# EAGLE design SparkFun_LTE_Stick_LARA_R6 (EAGLE 9.6.2)
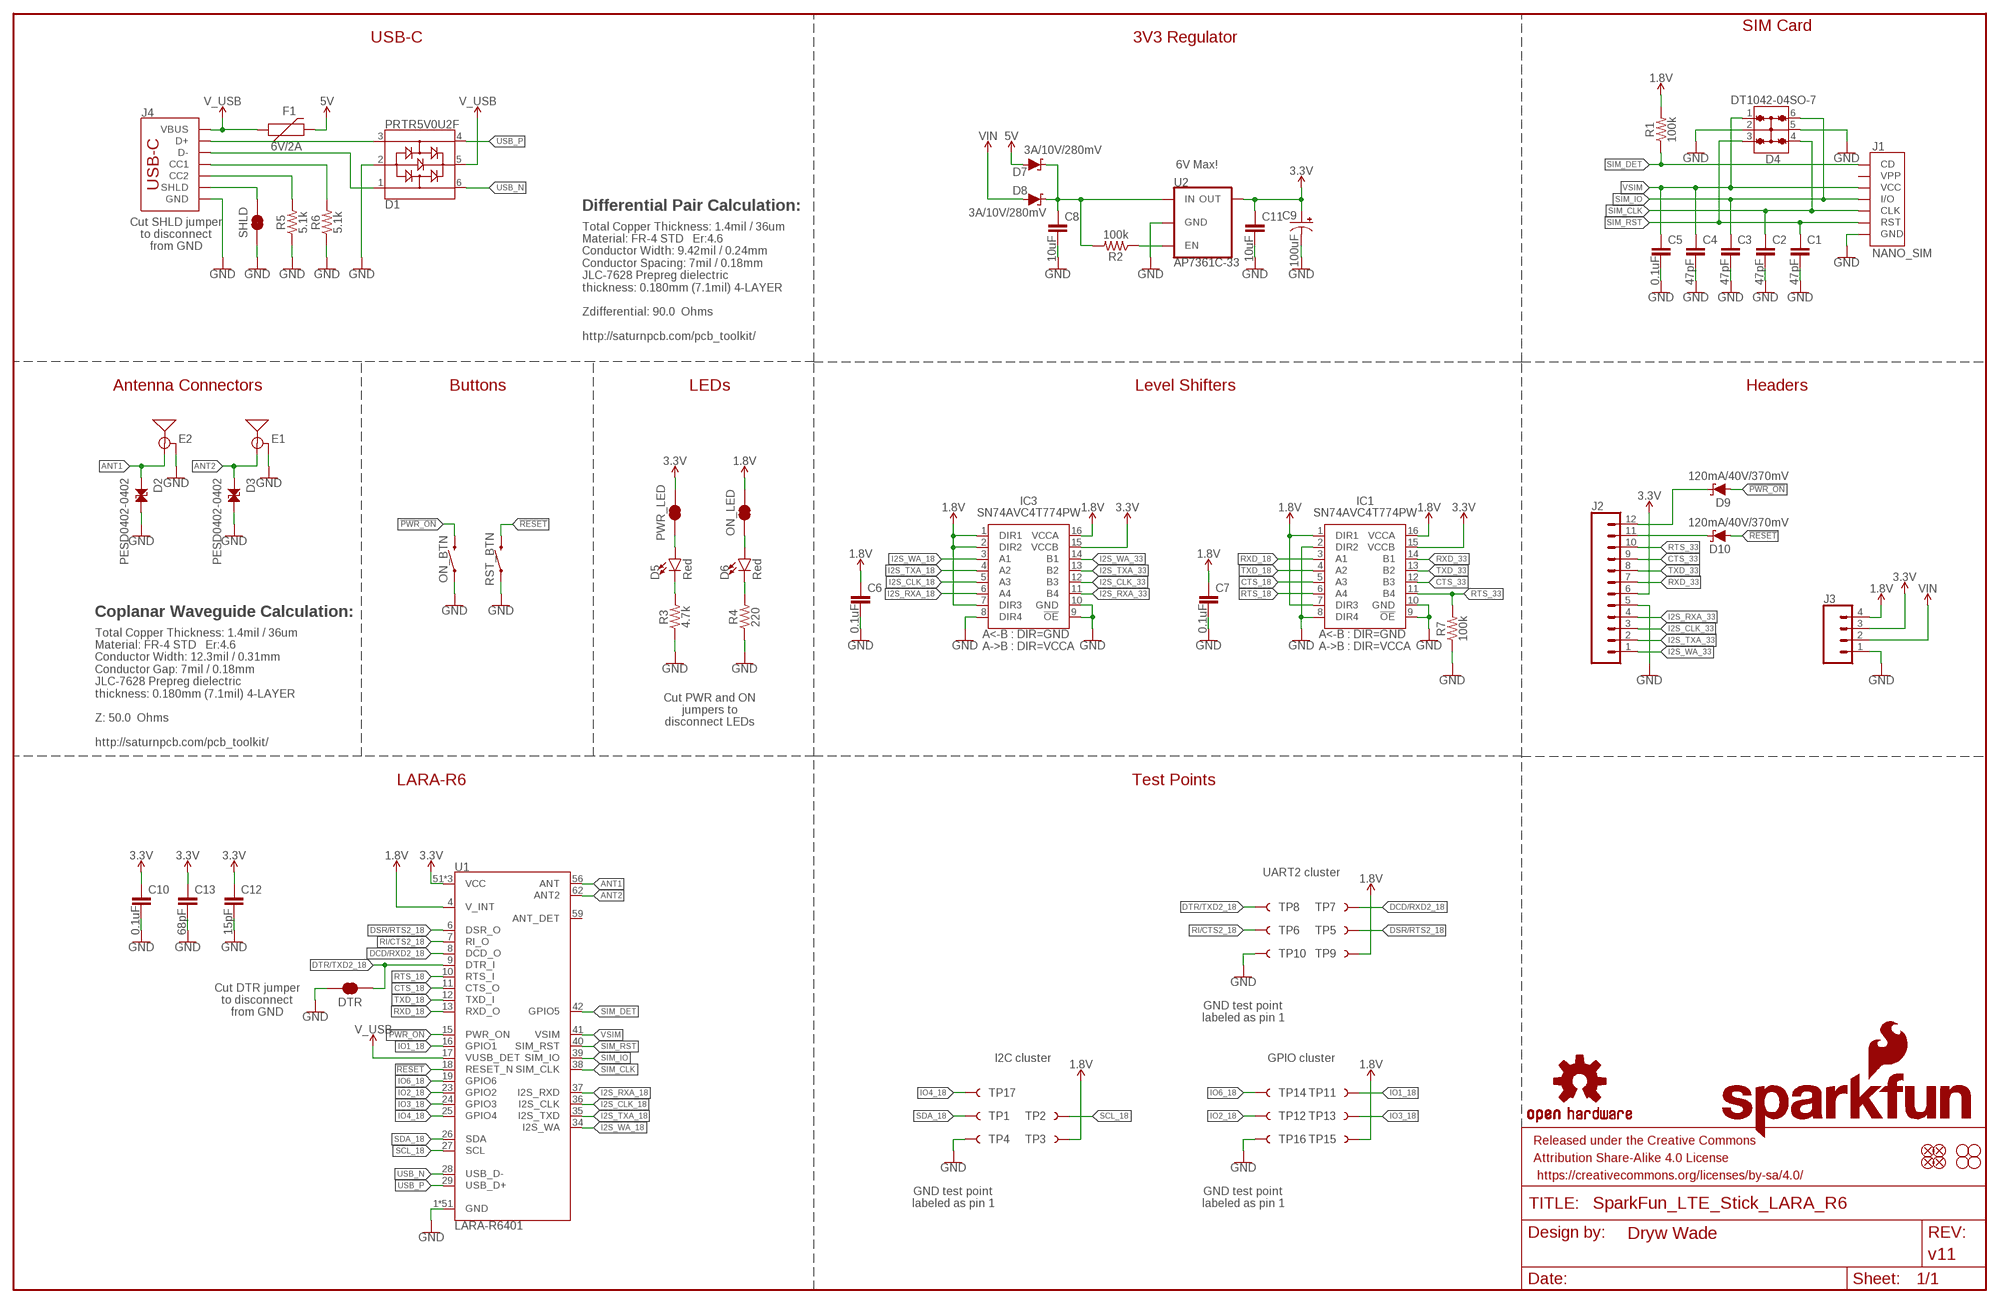
[diagram p0: schematic, sheet 1]

## Parts
C1  47pF  47PF-0603-50V-5%  [0603]
C2  47pF  47PF-0603-50V-5%  [0603]
C3  47pF  47PF-0603-50V-5%  [0603]
C4  47pF  47PF-0603-50V-5%  [0603]
C5  0.1uF  0.1UF-0603-25V-5%  [0603]
C6  0.1uF  0.1UF-0603-25V-5%  [0603]
C7  0.1uF  0.1UF-0603-25V-5%  [0603]
C8  10uF  10UF-0805-25V-10%  [0805]
C9  100uF  100UF-POLAR-35V-20%(ELEC)  [PANASONIC_D]
C10  0.1uF  0.1UF-0603-25V-5%  [0603]
C11  10uF  10UF-0805-25V-10%  [0805]
C12  15pF  15PF-0603-50V-5%  [0603]
C13  68pF  68PF-0603-50V-5%  [0603]
D1  PRTR5V0U2F  [SOT886]
D2  PESD0402-0402  [0402]
D3  PESD0402-0402  [0402]
D4  DT1042-04SO-7  TVS_DIODE_ARRAY_4_ESDA6V1BC6  [SOT23-6L]
D5  Red  LED-RED_0603-KB  [LED-0603]
D6  Red  LED-RED_0603-KB  [LED-0603]
D7  3A/10V/280mV  DIODE-SCHOTTKY-BAT60A  [SOD-323]
D8  3A/10V/280mV  DIODE-SCHOTTKY-BAT60A  [SOD-323]
D9  120mA/40V/370mV  DIODE-SCHOTTKY-RB751S40  [SOD-523]
D10  120mA/40V/370mV  DIODE-SCHOTTKY-RB751S40  [SOD-523]
DTR  JUMPER-SMT_2_NC_TRACE_SILK  [SMT-JUMPER_2_NC_TRACE_SILK]
E1  ANTENNA-SMA-GROUNDEDEDGE_SMA  [SMA-EDGE]
E2  ANTENNA-SMA-GROUNDEDEDGE_SMA  [SMA-EDGE]
F1  6V/2A  PPTC_6V2A  [1210]
FD1  FIDUCIAL1X2  [FIDUCIAL-1X2]
FD2  FIDUCIAL1X2  [FIDUCIAL-1X2]
FD3  FIDUCIAL1X2  [FIDUCIAL-1X2]
FD4  FIDUCIAL1X2  [FIDUCIAL-1X2]
FRAME1  FRAME-LEDGER  [CREATIVE_COMMONS]
H1  STAND-OFF  [STAND-OFF]
H2  STAND-OFF  [STAND-OFF]
H3  STAND-OFF  [STAND-OFF]
H4  STAND-OFF  [STAND-OFF]
IC1  SN74AVC4T774PW  [SOP65P640X120-16N]
IC3  SN74AVC4T774PW  [SOP65P640X120-16N]
J1  NANO_SIM  SIMHOLDER_WITH_CD-PUSHPUSH  [NANO_SIM_PP]
J2  CONN_12NO_SILK  [1X12_NO_SILK]
J3  CONN_041X04_NO_SILK_NO_POP  [1X04_NO_SILK]
J4  USB_C_4-LAYER_PADS  [USB-C-16P_4LAYER-PADS]
LOGO1  SFE_LOGO_NAME_FLAME.1_INCH  [SFE_LOGO_NAME_FLAME_.1]
LOGO2  OSHW-LOGOM  [OSHW-LOGO-M]
ON_BTN  MOMENTARY-SWITCH-SPST-SMD-4.6X2.8MM  [TACTILE_SWITCH_SMD_4.6X2.8MM]
ON_LED  JUMPER-SMT_2_NC_TRACE_SILK  [SMT-JUMPER_2_NC_TRACE_SILK]
PWR_LED  JUMPER-SMT_2_NC_TRACE_SILK  [SMT-JUMPER_2_NC_TRACE_SILK]
R1  100k  100KOHM-0603-1/10W-1%  [0603]
R2  100k  100KOHM-0603-1/10W-1%  [0603]
R3  4.7k  4.7KOHM-0603-1/10W-1%  [0603]
R4  220  220OHM-0603-1/10W-1%  [0603]
R5  5.1k  5.1KOHM5.1KOHM-0603-1/10W-1%  [0603]
R6  5.1k  5.1KOHM5.1KOHM-0603-1/10W-1%  [0603]
R7  100k  100KOHM-0603-1/10W-1%  [0603]
RST_BTN  MOMENTARY-SWITCH-SPST-SMD-4.6X2.8MM  [TACTILE_SWITCH_SMD_4.6X2.8MM]
SHLD  JUMPER-SMT_2_NC_TRACE_SILK  [SMT-JUMPER_2_NC_TRACE_SILK]
TP1  TEST-POINT3X5  [PAD.03X.05]
TP2  TEST-POINT3X5  [PAD.03X.05]
TP3  TEST-POINT3X5  [PAD.03X.05]
TP4  TEST-POINT3X5  [PAD.03X.05]
TP5  TEST-POINT3X5  [PAD.03X.05]
TP6  TEST-POINT3X5  [PAD.03X.05]
TP7  TEST-POINT3X5  [PAD.03X.05]
TP8  TEST-POINT3X5  [PAD.03X.05]
TP9  TEST-POINT3X5  [PAD.03X.05]
TP10  TEST-POINT3X5  [PAD.03X.05]
TP11  TEST-POINT3X5  [PAD.03X.05]
TP12  TEST-POINT3X5  [PAD.03X.05]
TP13  TEST-POINT3X5  [PAD.03X.05]
TP14  TEST-POINT3X5  [PAD.03X.05]
TP15  TEST-POINT3X5  [PAD.03X.05]
TP16  TEST-POINT3X5  [PAD.03X.05]
TP17  TEST-POINT3X5  [PAD.03X.05]
U1  LARA-R6401  LARA-R6_R6401_USA  [LARA-LGA]
U2  AP7361C-33  AP7361C-33FGEUDFN-8  [UDFN-8]

## Nets
1.8V: C6.1 C7.1 IC1.1(DIR1) IC1.7(DIR3) IC1.16(VCCA) IC3.1(DIR1) IC3.2(DIR2) IC3.7(DIR3) IC3.16(VCCA) J3.4 ON_LED.2 R1.2 TP3.1 TP9.1 TP15.1 U1.4(V_INT)
3.3V: C9.+ C10.1 C11.1 C12.1 C13.1 IC1.15(VCCB) IC3.15(VCCB) J2.6 J3.3 PWR_LED.2 U1.51(VCC) U1.52(VCC) U1.53(VCC) U2.1(OUT)
5V: D7.A F1.2
!PWR_ON!: D9.A ON_BTN.3 ON_BTN.4 U1.15(PWR_ON)
!RESET!: D10.A RST_BTN.3 RST_BTN.4 U1.18(RESET_N)
ANT1 [RF]: D2.1 E2.SIG(SIGNAL) U1.56(ANT)
ANT2 [RF]: D3.1 E1.SIG(SIGNAL) U1.62(ANT2)
CTS_18: IC1.5(A3) U1.11(CTS_O)
CTS_33: IC1.12(B3) J2.9
DCD/RXD2_18: TP7.1 U1.8(DCD_O)
DSR/RTS2_18: TP5.1 U1.6(DSR_O)
DTR/TXD2_18: DTR.2 TP8.1 U1.9(DTR_I)
EN: R2.1 U2.5(EN)
GND: C1.2 C2.2 C3.2 C4.2 C5.2 C6.2 C7.2 C8.2 C9.- C10.2 C11.2 C12.2 C13.2 D1.2 D2.2 D3.2 D4.2 D4.5 DTR.1 E1.GND@0(GND) E1.GND@1(GND) E1.GND@2(GND) E1.GND@3(GND) E2.GND@0(GND) E2.GND@1(GND) E2.GND@2(GND) E2.GND@3(GND) IC1.2(DIR2) IC1.8(DIR4) IC1.9(!OE) IC1.10(GND) IC3.8(DIR4) IC3.9(!OE) IC3.10(GND) J1.A1(GND) J1.A2(GND) J1.A3(GND) J1.A4(GND) J1.C5(GND) J2.5 J3.1 J4.GND J4.GND2(GND) ON_BTN.1 ON_BTN.2 R3.1 R4.1 R5.1 R6.1 R7.1 RST_BTN.1 RST_BTN.2 SHLD.1 TP4.1 TP10.1 TP16.1 U1.1(GND) U1.3(GND) U1.5(GND) U1.14(GND) U1.20(GND) U1.21(GND) U1.22(GND) U1.30(GND) U1.32(GND) U1.43(GND) U1.50(GND) U1.54(GND) U1.55(GND) U1.57(GND) U1.58(GND) U1.60(GND) U1.61(GND) U1.63(GND) U1.64(GND) U1.65(GND) U1.66(GND) U1.67(GND) U1.68(GND) U1.69(GND) U1.70(GND) U1.71(GND) U1.72(GND) U1.73(GND) U1.74(GND) U1.75(GND) U1.76(GND) U1.77(GND) U1.78(GND) U1.79(GND) U1.80(GND) U1.81(GND) U1.82(GND) U1.83(GND) U1.84(GND) U1.85(GND) U1.86(GND) U1.87(GND) U1.88(GND) U1.89(GND) U1.90(GND) U1.91(GND) U1.92(GND) U1.93(GND) U1.94(GND) U1.95(GND) U1.96(GND) U2.4(GND) U2.EP(GND)
I2S_CLK_18: IC3.5(A3) U1.36(I2S_CLK)
I2S_CLK_33: IC3.12(B3) J2.3
I2S_RXA_18: IC3.6(A4) U1.37(I2S_RXD)
I2S_RXA_33: IC3.11(B4) J2.4
I2S_TXA_18: IC3.4(A2) U1.35(I2S_TXD)
I2S_TXA_33: IC3.13(B2) J2.2
I2S_WA_18: IC3.3(A1) U1.34(I2S_WA)
I2S_WA_33: IC3.14(B1) J2.1
IO1_18: TP11.1 U1.16(GPIO1)
IO2_18: TP12.1 U1.23(GPIO2)
IO3_18: TP13.1 U1.24(GPIO3)
IO4_18: TP17.1 U1.25(GPIO4)
IO6_18: TP14.1 U1.19(GPIO6)
N$1: D5.C R3.2
N$2: D5.A PWR_LED.1
N$3: D6.A ON_LED.1
N$4: D6.C R4.2
N$5: D10.C J2.11
N$6: D9.C J2.12
N$7: C8.1 D7.C D8.C R2.2 U2.8(IN)
N$8: J4.B5(CC2) R5.2
N$9: J4.A5(CC1) R6.2
N$10: D1.3 J4.A6(D+) J4.B6(D+)
N$11: D1.1 J4.A7(D-) J4.B7(D-)
RI/CTS2_18: TP6.1 U1.7(RI_O)
RTS_18: IC1.6(A4) U1.10(RTS_I)
RTS_33: IC1.11(B4) J2.10 R7.2
RXD_18: IC1.3(A1) U1.13(RXD_O)
RXD_33: IC1.14(B1) J2.7
SCL_18: TP2.1 U1.27(SCL)
SDA_18: TP1.1 U1.26(SDA)
SHLD: J4.SHLD1(SHLD) J4.SHLD2(SHLD) J4.SHLD3(SHLD) J4.SHLD4(SHLD) SHLD.2
SIM_CLK: C2.1 D4.4 J1.C3(CLK) U1.38(SIM_CLK)
SIM_DET: J1.CD R1.1 U1.42(GPIO5)
SIM_IO: C3.1 D4.6 J1.C7(I/O) U1.39(SIM_IO)
SIM_RST: C1.1 D4.3 J1.C2(RST) U1.40(SIM_RST)
TXD_18: IC1.4(A2) U1.12(TXD_I)
TXD_33: IC1.13(B2) J2.8
USB_N [USB]: D1.6 U1.28(USB_D-)
USB_P [USB]: D1.4 U1.29(USB_D+)
V_USB: D1.5 F1.1 J4.VBUS1(VBUS) J4.VBUS2(VBUS) U1.17(VUSB_DET)
VIN: D8.A J3.2
VSIM: C4.1 C5.1 D4.1 J1.C1(VCC) U1.41(VSIM)
Unconnected: J1.C6(VPP) U1.59(ANT_DET)

## Notes on the sheet
- SIM Card
- USB-C | 3V3 Regulator
- 6V Max!
- Differential Pair Calculation:
- Total Copper Thickness: 1.4mil / 36um
  Material: FR-4 STD   Er:4.6
  Conductor Width: 9.42mil / 0.24mm
  Conductor Spacing: 7mil / 0.18mm
  JLC-7628 Prepreg dielectric
  thickness: 0.180mm (7.1mil) 4-LAYER
  
  Zdifferential: 90.0  Ohms
  
  http://saturnpcb.com/pcb_toolkit/
- Cut SHLD jumper
  to disconnect
  from GND
- Antenna Connectors | Buttons | LEDs | Level Shifters | Headers
- Coplanar Waveguide Calculation:
- Total Copper Thickness: 1.4mil / 36um
  Material: FR-4 STD   Er:4.6
  Conductor Width: 12.3mil / 0.31mm
  Conductor Gap: 7mil / 0.18mm
  JLC-7628 Prepreg dielectric
  thickness: 0.180mm (7.1mil) 4-LAYER
  
  Z: 50.0  Ohms
  
  http://saturnpcb.com/pcb_toolkit/
- Cut PWR and ON
  jumpers to
  disconnect LEDs
- LARA-R6 | Test Points
- UART2 cluster
- Cut DTR jumper
  to disconnect
  from GND
- GND test point
  labeled as pin 1
- I2C cluster | GPIO cluster
- GND test point
  labeled as pin 1
- GND test point
  labeled as pin 1

## Library data of the parts
C1-C4 = SparkFun-Capacitors:47PF: 47pF ceramic capacitors A capacitor is a passive two-terminal electrical component used to store electrical energy temporarily in an electric field.; PROD_ID: CAP-08913
C5-C7 C10 = SparkFun-Capacitors:0.1UF: 0.1µF ceramic capacitors A capacitor is a passive two-terminal electrical component used to store electrical energy temporarily in an electric field.; PROD_ID: CAP-08604
C8 C11 = SparkFun-Capacitors:10UF: 10.0µF ceramic capacitors A capacitor is a passive two-terminal electrical component used to store electrical energy temporarily in an electric field.; PROD_ID: CAP-14259
C9 = SparkFun-Capacitors:100UF-POLAR: 100µF polarized capacitors A capacitor is a passive two-terminal electrical component used to store electrical energy temporarily in an electric field.; PROD_ID: CAP-20814
C12 = SparkFun-Capacitors:15PF: 15pF ceramic capacitors A capacitor is a passive two-terminal electrical component used to store electrical energy temporarily in an electric field.; PROD_ID: CAP-07881
C13 = SparkFun-Capacitors:68PF: 68pF ceramic capacitors A capacitor is a passive two-terminal electrical component used to store electrical energy temporarily in an electric field.; PROD_ID: CAP-14092
D1 = SparkFun-IC-Power:PRTR5V0U2: A small ESD protection device. Most commonly used on USB D+/D- signals to protect large, expensive, or especially sensitive USB enabled devices.; PROD_ID: DIO-14084
D2 D3 = SparkFun-DiscreteSemi:PESD0402: ESD protection diode PESD is used to protect a signal line from ESD.; DIGIKEY_PART: PESD0402-140CT-ND; MOUSE_PART: 650-PESD0402-140; PROD_ID: DIO-15359
D4 = SparkFun-DiscreteSemi:TVS_DIODE_ARRAY_4; PROD_ID: DIO-14095
D5 D6 = SparkFun-LED:LED-RED: Red SMD LED Used in manufacturing of most products at SparkFun Packages: 0603 - KB - KingBright (DIO-17976) SMD 0603 package [Datasheet] <https://www.kingbrightusa.com/images/catalog/SPEC/APT1608SURCK.pdf> 0603 - (DIO-00819, has gone EOL) SMD 0603 package 0603 SMART - SMD 0603 SMART package ( more efficient and expensive)[Product Link] <http://www.osram-os.com/Graphics/XPic2/00077099_0.pdf> 1206 - SMD1206 package [Product Link] <https://www.sparkfun.com/datasheets/DevTools/LilyPad/Q150OVS4.pdff> SparkFun Products: Pro Mini 328 -5V <https://www.sparkfun.com/products/821> RedBoard <https://www.sparkfun.com/products/12757> IOIO-OTG <https://www.sparkfun.com/products/13613>; PROD_ID: DIO-17976
D7 D8 = SparkFun-DiscreteSemi:DIODE-SCHOTTKY: Schottky diode A Schottky diode is a semiconductor diode which has a low forward voltage drop and a very fast switching action.; PROD_ID: DIO-14072
D9 D10 = SparkFun-DiscreteSemi:DIODE-SCHOTTKY: Schottky diode A Schottky diode is a semiconductor diode which has a low forward voltage drop and a very fast switching action.; PROD_ID: DIO-11018
DTR ON_LED PWR_LED SHLD = SparkFun-Jumpers:JUMPER-SMT_2_NC_TRACE: Normally closed trace jumper This jumper has a trace between two pads so it's normally closed (NC). Use a razor knife to open the connection. For best results follow the IPC guidelines for cutting traces: Cutout at least 0.063 mm (0.005 in). Remove all loose material to clean up the cut area. Seal the cut with an approved epoxy. Reapply solder to reclose the connection.
E1 E2 = SparkFun-RF:ANTENNA-SMA-GROUNDED: SMA Antenna Connector w/ Ground Edge-mount and SMD SMA connectors for RF Antennas. **4-LAYER BOARD WARNING!!** When designing a 4-layer board using any of the SMD variants, you will need to manually add a cutout polygon on any internal power layers to make sure that you don't end up with exposed copper around the edge of the routed hole for these connectors. Exposed power copper could then short to the connector body - and that would be bad. Why hasn't anyone added the cutout polygons directly to the connector footprint? Well, your internal layers (usually 2 and 15) may be covered with GND polygons and you might well want the copper to go all the way to the edge, especially under the connector SIGNAL pin. So adding cutouts to the footprint might make matters worse, not better...; PROD_ID: CONN-19593
F1 = SparkFun-Fuses:PPTC: Resettable Fuse PPTC Resettable Fuse. Really a sort of resistor with a polymeric positive temperature coefficient whose resistance increases dramatically with an increase in temperature. When heated by the power passing through the resistance rises causing the current to be limited, protecting the circuit. This is achieved by the transition of the polymer from a crystalline to an amorphous state where the conductive carbon separates breaking the conductive pathways found in the cool crystalline structure. When a PPTC cools back down it resumes conducting letting the circuit turn back on. SparkFun Products: SparkFun RedBoard - Programmed with Arduino Pro Micro - 5V/16MHz Arduino Pro 328 - 5V/16MHz MP3 Trigger; PROD_ID: RES-14313
FD1-FD4 = SparkFun-Aesthetics:FIDUCIAL: Fiducial Alignment Points Point-of-reference for pick-and-place machines and other optical instruments.
FRAME1 = SparkFun-Aesthetics:FRAME-LEDGER: Schematic Frame - Ledger Standard 11x14 US Ledger frame; DESIGNER: Dryw Wade; REV: v11
H1-H4 = SparkFun-Hardware:STAND-OFF: Stand Off Drill holes for mechanically mounting via screws, standoffs, etc. Note: Use the keepout ring to avoid running the screw head into surrounding components. Variant Overviews STAND-OFF - Mechanical footprint for a #4 phillips button head screw. STAND-OFF-TIGHT - Mechanical footprint for a #4 phillips button head screw, Example SparkFun Products Screw - Phillips Head (1/4", 4-40, 10 pack) (PRT-10453) Screw - Phillips Head (1/2", 4-40, 10 pack) (PRT-10452) Screw - Phillips Head (3/4", 4-40, 10 pack) (PRT-10451) Screw - Phillips Head (1", 4-40, 10 pack) (PRT-10450)
IC1 IC3 = SparkFun-IC-Comms:SN74AVC4T774PW: Texas Instruments,SN74AVC4T774PW,IC, Texas Instruments SN74AVC4T774PW, Dual, Bus Transceiver, 4-Bit Non-Inverting 3-State, 1.2 3.6 V, 16-Pin TSSOP Source: Datasheet; PROD_ID: IC-15360
J1 = SparkFun-Connectors:SIMHOLDER_WITH_CD: SIM Cellular Card Socket SMT 6 pin standard connection. SparkFun Products: SIM Socket <https://www.sparkfun.com/products/548> SparkFun Cellular Shield - MG2639 <https://www.sparkfun.com/products/13120> SparkFun SIM Card Socket Breakout <https://www.sparkfun.com/products/573>; PROD_ID: CONN-16272
J2 = SparkFun-Connectors:CONN_12: Multi connection point. Often used as Generic Header-pin footprint for 0.1 inch spaced/style header connections On any of the 0.1 inch spaced packages, you can populate with these: Break Away Headers - Straight (PRT-00116) Break Away Male Headers - Right Angle (PRT-00553) Female Headers (PRT-00115) Break Away Headers - Machine Pin (PRT-00117) Break Away Female Headers - Swiss Machine Pin (PRT-00743) For SCREWTERMINALS and SPRING TERMINALS visit here: Screw Terimnals on SparkFun.com (5mm/3.5mm/2.54mm spacing) This device is also useful as a general connection point to wire up your design to another part of your project. Our various solder wires solder well into these plated through hole pads. Hook-Up Wire - Assortment (Stranded, 22 AWG) (PRT-11375) Hook-Up Wire - Assortment (Solid Core, 22 AWG) (PRT-11367) View the entire wire category on our website here Special notes: Molex polarized connector foot print use with SKU : PRT-08231 with associated crimp pins and housings. 1MM SMD Version SKU: PRT-10208 NOTES ON THE VARIANTS LOCK and LOCK_LONGPADS... This footprint was designed to help hold the alignment of a through-hole component (i.e. 6-pin header) while soldering it into place. You may notice that each hole has been shifted either up or down by 0.005 of an inch from it's more standard position (which is a perfectly straight line). This slight alteration caused the pins (the squares in the middle) to touch the edges of the holes. Because they are alternating, it causes a "brace" to hold the component in place. 0.005 has proven to be the perfect amount of "off-center" position when using our standard breakaway headers. Although looks a little odd when you look at the bare footprint, once you have a header in there, the alteration is very hard to notice. Also,if you push a header all the way into place, it is covered up entirely on the bottom side.
J3 = SparkFun-Connectors:CONN_04: Multi connection point. Often used as Generic Header-pin footprint for 0.1 inch spaced/style header connections On any of the 0.1 inch spaced packages, you can populate with these: Break Away Headers - Straight (PRT-00116) Break Away Male Headers - Right Angle (PRT-00553) Female Headers (PRT-00115) Break Away Headers - Machine Pin (PRT-00117) Break Away Female Headers - Swiss Machine Pin (PRT-00743) For SCREWTERMINALS and SPRING TERMINALS visit here: Screw Terimnals on SparkFun.com (5mm/3.5mm/2.54mm spacing) This device is also useful as a general connection point to wire up your design to another part of your project. Our various solder wires solder well into these plated through hole pads. Hook-Up Wire - Assortment (Stranded, 22 AWG) (PRT-11375) Hook-Up Wire - Assortment (Solid Core, 22 AWG) (PRT-11367) View the entire wire category on our website here Special notes: Molex polarized connector foot print use with SKU : PRT-08231 with associated crimp pins and housings. 1MM SMD Version SKU: PRT-10208
J4 = SparkFun-Connectors:USB_C: USB Type C 16Pin Connector Super Speed pins not available on the 16-pin purely SMD connector so this part is best for USB 2.0 implementations. D1 and D2 are tied together enabling D+/- no matter which way the cable is plugged into the connector. The two channel configuration pins (CC1/2) are exposed. These are normally connected to ground via 5.1k resistors but can be reconfigured for high current/high power applications. **4-LAYER BOARD WARNING!!** If designing 4-layer board, make sure to select the variant _4-LAYER-ISOLATED. The linked footprint (USB-C-16-4LAYER-ISOLATED) includes some very necessary cutout polygons in the inner layers (2 and 15). This prevents the PTH mounting shield legs on the USB connector from electrically connecting any other polygons on the inner layers (usually VCC and GND).; PROD_ID: CONN-14122
LOGO1 = SparkFun-Aesthetics:SFE_LOGO_NAME_FLAME: SparkFun Font Logo w/ Flame This is the SparkFun full logo. The logo on the schematic will always be the same size; the package variant is the height of the flame part of the logo. Default layer for the logo on the board is tSilk.
LOGO2 = SparkFun-Aesthetics:OSHW-LOGO: Open-Source Hardware (OSHW) Logo This logo indicates the piece of hardware it is found on incorporates a OSHW license and/or adheres to the definition of open source hardware found here: http://freedomdefined.org/OSHW
ON_BTN RST_BTN = SparkFun-Switches:MOMENTARY-SWITCH-SPST: Momentary Switch (Pushbutton) - SPST Normally-open (NO) SPST momentary switches (buttons, pushbuttons). Variants PTH-12MM - 12mm square, through-hole Momentary Pushbutton Switch - 12mm Square (COM-09190) PTH-6.0MM, PTH-6.0MM-KIT - 6.0mm square, through-hole Mini Pushbutton Switch (COM-00097) KIT package intended for soldering kit's - only one side of pads' copper is exposed. PTH-RIGHT-ANGLE-KIT - Right-angle, through-hole Right Angle Tactile Button - Used on SparkFun BigTime Watch Kit SMD-12MM - 12mm square, surface-mount Tactile Button - SMD (12mm) (COM-12993) Used on SparkFun PicoBoard SMD-4.5MM - 4.5mm Square Trackball Switch Used on SparkFun Blackberry Trackballer Breakout SMD-4.6MMX2.8MM - 4.60mm x 2.80mm, surface mount Used on SparkFun Pro Micro - RP2040 SMD-5.2MM, SMD-5.2-REDUNDANT - 5.2mm square, surface-mount Mini Pushbutton Switch - SMD (COM-08720) Used on Arduino Pro Mini REDUNDANT package connects both switch circuits together SMD-6.0X3.5MM - 6.0 x 3.5mm, surface mount Momentary Reset Switch SMD (COM-08229) SMD-6.2MM-TALL - 6.2mm square, surface mount Tactile Button - SMD (6mm) Used on SparkFun Digital Sandbox SMD-RIGHT-ANGLE - Right-angle, surface mount Used on SparkFun Block for Intel® Edison - Arduino; PROD_ID: SWCH-15606
R1 R2 R7 = SparkFun-Resistors:100KOHM: 100kΩ resistor A resistor is a passive two-terminal electrical component that implements electrical resistance as a circuit element. Resistors act to reduce current flow, and, at the same time, act to lower voltage levels within circuits. - Wikipedia; PROD_ID: RES-07828
R3 = SparkFun-Resistors:4.7KOHM: 4.7kΩ resistor A resistor is a passive two-terminal electrical component that implements electrical resistance as a circuit element. Resistors act to reduce current flow, and, at the same time, act to lower voltage levels within circuits. - Wikipedia; PROD_ID: RES-07857
R4 = SparkFun-Resistors:220OHM: 220Ω resistor A resistor is a passive two-terminal electrical component that implements electrical resistance as a circuit element. Resistors act to reduce current flow, and, at the same time, act to lower voltage levels within circuits. - Wikipedia; PROD_ID: RES-07861
R5 R6 = SparkFun-Resistors:5.1KOHM; PROD_ID: RES-12083
TP1-TP17 = SparkFun-Connectors:TEST-POINT: SparkFun Test Points Bare copper test points for troubleshooting or In-Circuit-Testing. These are used by our Production team for verifying production board runs using pogo-pins on test beds. SparkFun Products: SparkFun LSM9DS1 Breakout <https://www.sparkfun.com/products/13284> SparkFun PSOC <https://www.sparkfun.com/products/13714> SparkFun Load Cell Amplifier <https://www.sparkfun.com/products/13879>
U1 = SparkFun-RF:LARA-R6: u-blox LARA-R6 single or multi-mode LTE Cat 1 modules; PROD_ID: IC-16756
U2 = SparkFun-IC-Power:AP7361C-33FGE: AP7361C 3.3V LDO Regulator; PROD_ID: VREG-14094

## Net classes
1 USB: width 0.239 mm, clearance 0.178 mm
2 RF: width 0.312 mm, clearance 0.178 mm to class 0

## Board
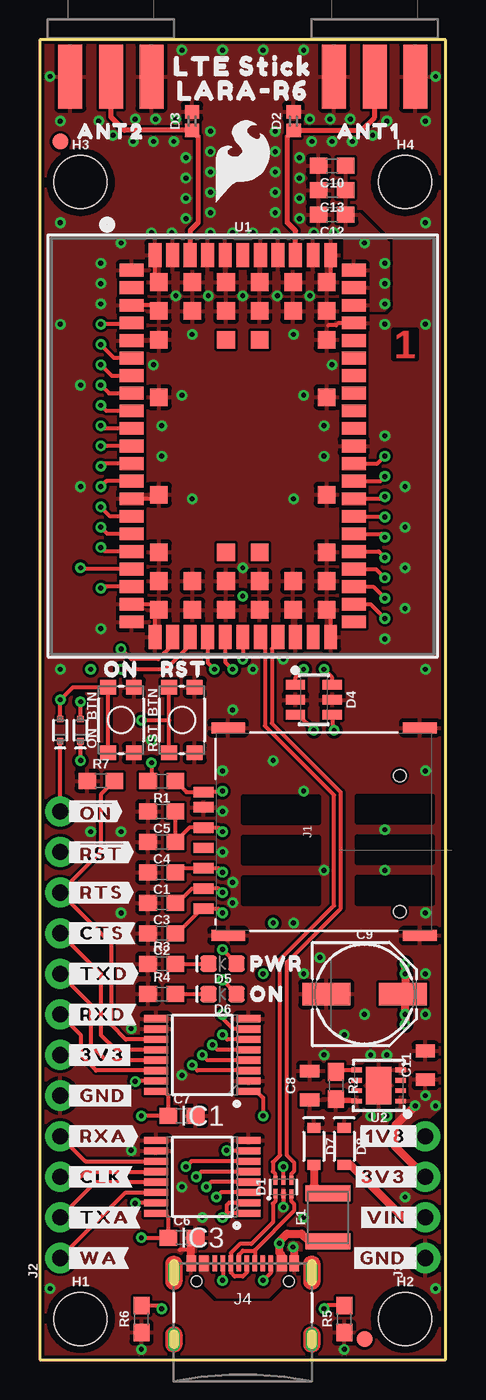
[diagram p1: board, top side]
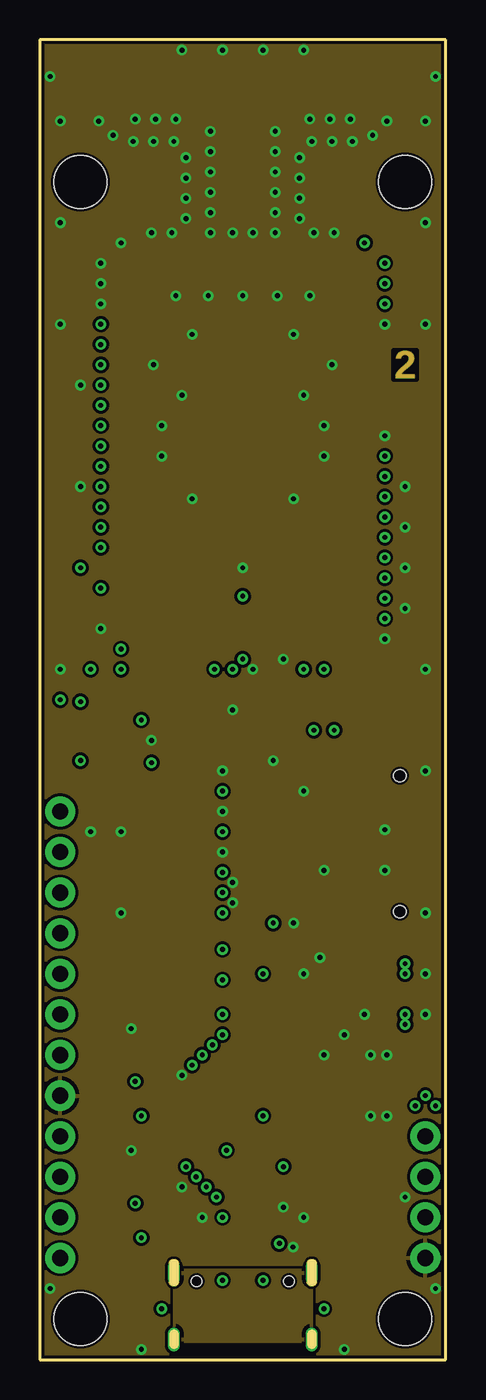
[diagram p2: board, inner layer Route2]
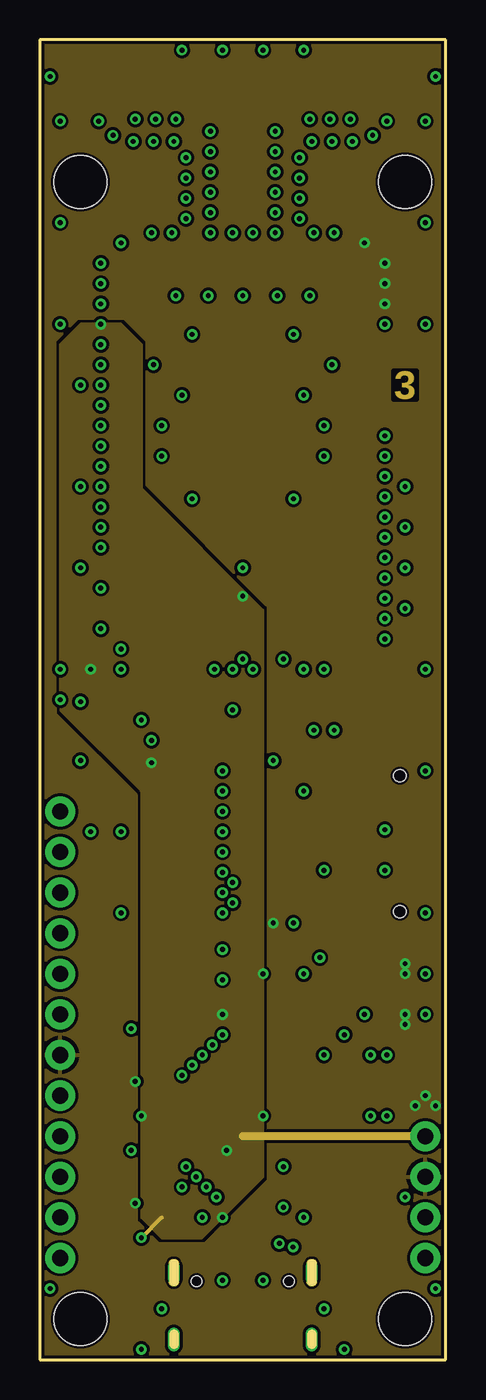
[diagram p3: board, inner layer Route15]
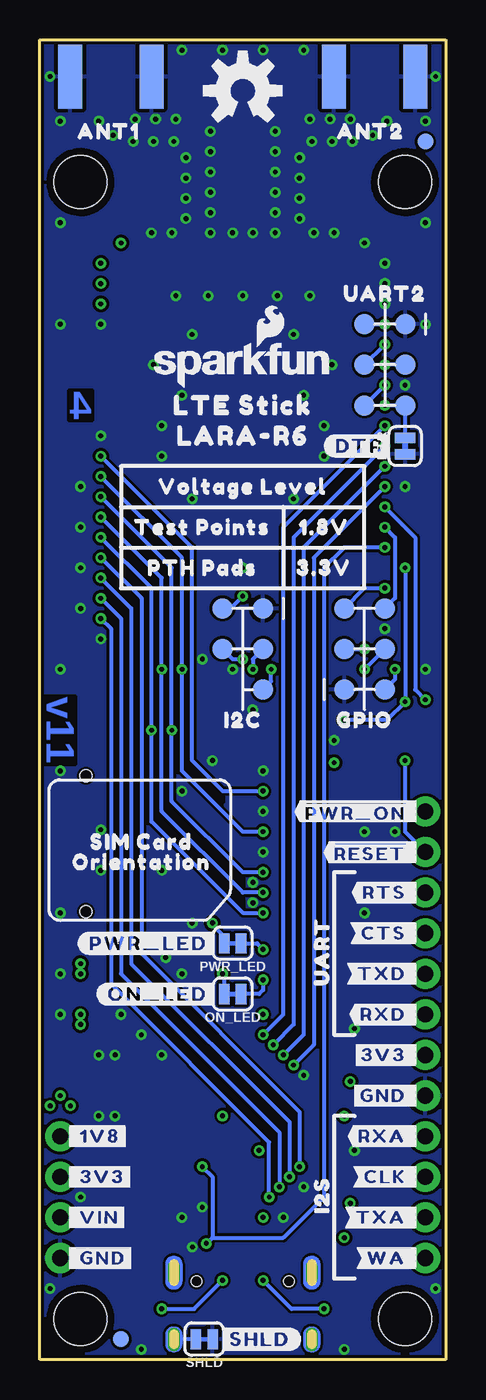
[diagram p4: board, bottom side, seen from below]

Size 25.4 x 82.55 mm. Coordinates in mm from the lower left corner, seen from the top.
Outline: 0,0 25.4,0 25.4,82.55 0,82.55 0,0
Copper layers (1+2*15+16): Top 0.035559375mm / dielectric 0.47751875mm / Route2 0.035559375mm / dielectric 0.47751875mm / Route15 0.035559375mm / dielectric 0.47751875mm / Bottom 0.035559375mm
Design rules "SparkFun-4-Layer-General-JLCPCB": minimum track width 7mil, minimum drill 12mil, track to track 7mil, track to pad 7mil, pad to pad 7mil, via to via 7mil, smd to smd 7mil, copper to edge 7mil, drill to drill 7mil, minimum pad ring 7mil, minimum via ring 7mil, stop-mask expansion 3mil, vias tented up to drill 25mil, thermal gap 10mil
tRestrict: area 7.1,23.6 to 7.2,24; area 7.1,13.3 to 7.5,13.5; area 7.1,21 to 7.5,21.1
bRestrict: area 12.7,28.4 to 12.8,28.7; area 12.7,29.7 to 12.8,30; area 14,34.9 to 14.1,35.2

### Footprints (pad centres in the part's own frame; a part is rotated, then mirrored left to right if it is on the bottom)
0603 = smd 1.1 x 1: 1 -0.85,0; 2 0.85,0
0805 = smd 0.8 x 1.2: 1 -0.9,0; 2 0.9,0
PANASONIC_D = smd 3 x 1.4: + 2.4,0; - -2.4,0
SOT886 = smd 0.61 x 0.25: 1 -0.405,0.5 | smd 0.56 x 0.25: 2 -0.43,0; 3 -0.43,-0.5; 4 0.43,-0.5; 5 0.43,0; 6 0.43,0.5
0402 = smd 0.85 x 0.9: 1 -0.58,0; 2 0.58,0
SOT23-6L = smd 0.6 x 1.2: 1 -0.95,-1.15; 2 0,-1.15; 3 0.95,-1.15; 4 0.95,1.15; 5 0,1.15; 6 -0.95,1.15
LED-0603 = smd 1 x 1: A -0.877,0; C 0.877,0
SOD-323 = smd 0.63 x 0.83: A 1.15,0; C -1.15,0
SOD-523 = smd 0.4 x 0.4: A -0.7,0; C 0.7,0
SMT-JUMPER_2_NC_TRACE_SILK = smd 0.66 x 1.27: 1 -0.521,0; 2 0.521,0
SMA-EDGE = smd 1.5 x 4: GND@0 -2.54,0; GND@1 2.54,0; SIG 0,0 | smd 1.5 x 4 bottom: GND@2 -2.54,0; GND@3 2.54,0
1210 = smd 1 x 2.8: 1 -1.5,0; 2 1.5,0
FIDUCIAL-1X2 = smd 1 x 1: 1 0,0
STAND-OFF = hole 3.302: 0,0
SOP65P640X120-16N = smd 1.5 x 0.45: 1 -2.9,2.275; 2 -2.9,1.625; 3 -2.9,0.975; 4 -2.9,0.325; 5 -2.9,-0.325; 6 -2.9,-0.975; 7 -2.9,-1.625; 8 -2.9,-2.275; 9 2.9,-2.275; 10 2.9,-1.625; 11 2.9,-0.975; 12 2.9,-0.325; 13 2.9,0.325; 14 2.9,0.975; 15 2.9,1.625; 16 2.9,2.275
NANO_SIM_PP = smd 0.7 x 2.1: A1 6.495,6; A2 -6.495,6; A3 -6.495,-6; A4 6.495,-6 | smd 0.65 x 1.23: C1 0.255,7.535; C2 -2.285,7.535; C3 -4.825,7.535; C5 1.525,7.535; C6 -1.015,7.535; C7 -3.555,7.535; CD 2.475,7.535 | hole 0.75: 3.505,-4.75; -4.995,-4.75
1X12_NO_SILK = drill 1.016 pad 1.88: 1 0,0; 2 2.54,0; 3 5.08,0; 4 7.62,0; 5 10.16,0; 6 12.7,0; 7 15.24,0; 8 17.78,0; 9 20.32,0; 10 22.86,0; 11 25.4,0; 12 27.94,0
1X04_NO_SILK = drill 1.016 pad 1.88: 1 0,0; 2 2.54,0; 3 5.08,0; 4 7.62,0
USB-C-16P_4LAYER-PADS = smd 0.3 x 1: A5 -1.25,-0.34; A6 -0.25,-0.34; A7 0.25,-0.34; A8 1.25,-0.34; B5 1.75,-0.34; B6 0.75,-0.34; B7 -0.75,-0.34; B8 -1.75,-0.34 | smd 0.6 x 1: GND -3.225,-0.34; GND2 3.225,-0.34; VBUS1 -2.45,-0.34; VBUS2 2.45,-0.34 | drill 0.4 pad 0.6 long: SHLD1 -4.318,-0.915; SHLD2 4.318,-0.915; SHLD3 -4.318,-5.095; SHLD4 4.318,-5.095 | hole 0.65: -2.89,-1.445; 2.89,-1.445
TACTILE_SWITCH_SMD_4.6X2.8MM = smd 0.9 x 1: 1 -2.05,-0.8; 2 2.05,-0.8; 3 2.05,0.8; 4 -2.05,0.8
PAD.03X.05 = smd 1.27 x 1.27: 1 0,0
LARA-LGA = smd 0.8 x 1.5: 1 -11,-6.95; 2 -9.9,-6.95; 3 -8.8,-6.95; 4 -7.7,-6.95; 5 -6.6,-6.95; 6 -5.5,-6.95; 7 -4.4,-6.95; 8 -3.3,-6.95; 9 -2.2,-6.95; 10 -1.1,-6.95; 11 0,-6.95; 12 1.1,-6.95; 13 2.2,-6.95; 14 3.3,-6.95; 15 4.4,-6.95; 16 5.5,-6.95; 17 6.6,-6.95; 18 7.7,-6.95; 19 8.8,-6.95; 20 9.9,-6.95; 21 11,-6.95; 33 11,6.95; 34 9.9,6.95; 35 8.8,6.95; 36 7.7,6.95; 37 6.6,6.95; 38 5.5,6.95; 39 4.4,6.95; 40 3.3,6.95; 41 2.2,6.95; 42 1.1,6.95; 43 0,6.95; 44 -1.1,6.95; 45 -2.2,6.95; 46 -3.3,6.95; 47 -4.4,6.95; 48 -5.5,6.95; 49 -6.6,6.95; 50 -7.7,6.95; 51 -8.8,6.95; 52 -9.9,6.95; 53 -11,6.95 | smd 1.5 x 0.8: 22 11.95,-5.5; 23 11.95,-4.4; 24 11.95,-3.3; 25 11.95,-2.2; 26 11.95,-1.1; 27 11.95,0; 28 11.95,1.1; 29 11.95,2.2; 30 11.95,3.3; 31 11.95,4.4; 32 11.95,5.5; 54 -11.95,5.5; 55 -11.95,4.4; 56 -11.95,3.3; 57 -11.95,2.2; 58 -11.95,1.1; 59 -11.95,0; 60 -11.95,-1.1; 61 -11.95,-2.2; 62 -11.95,-3.3; 63 -11.95,-4.4; 64 -11.95,-5.5 | smd 1.1 x 1.1: 65 -10.25,-5.25; 66 -10.25,-3.15; 67 -10.25,-1.05; 68 -10.25,1.05; 69 -10.25,3.15; 70 -10.25,5.25; 71 -8.45,-5.25; 72 -8.45,-3.15; 73 -8.45,-1.05; 74 -8.45,1.05; 75 -8.45,3.15; 76 -8.45,5.25; 77 -6.65,-5.25; 78 -6.65,5.25; 79 -3.05,-5.25; 80 -3.05,5.25; 81 3.05,-5.25; 82 3.05,5.25; 83 6.65,-5.25; 84 6.65,5.25; 85 8.45,-5.25; 86 8.45,-3.15; 87 8.45,-1.05; 88 8.45,1.05; 89 8.45,3.15; 90 8.45,5.25; 91 10.25,-5.25; 92 10.25,-3.15; 93 10.25,-1.05; 94 10.25,1.05; 95 10.25,3.15; 96 10.25,5.25; 97 -6.65,-1.05; 98 -6.65,1.05; 99 6.65,-1.05; 100 6.65,1.05
UDFN-8 = smd 0.3 x 0.65: 1 -0.975,-1.375; 2 -0.325,-1.375; 3 0.325,-1.375; 4 0.975,-1.375; 5 0.975,1.375; 6 0.325,1.375; 7 -0.325,1.375; 8 -0.975,1.375 | smd 2.35 x 1.6: EP 0,0

### Placement (x,y rotation side)
C1  7.62,30.48 180 top
C2  7.62,26.67 180 top
C3  7.62,28.57 180 top
C4  7.62,32.38 180 top
C5  7.62,34.29 180 top
C6  8.89,7.62 0 top
C7  8.89,15.24 0 top
C8  16.89,17.14 90 top
C9  20.32,22.86 0 top
C10  18.29,74.68 180 top
C11  24.13,18.41 90 top
C12  18.29,71.63 180 top
C13  18.29,73.15 180 top
D1  15.24,10.79 90 top
D2  15.88,77.47 90 top
D3  9.53,77.47 90 top
D4  17.14,41.27 270 top
D5  11.43,24.77 180 top
D6  11.43,22.86 180 top
D7  17.14,13.34 270 top
D8  19.05,13.34 270 top
D9  1.27,39.37 270 top
D10  2.54,39.37 270 top
DTR  2.54,57.15 90 bottom
E1  4.45,80.26 0 top
E2  20.95,80.26 0 top
F1  18.03,8.89 90 top
FD1  1.27,76.2 0 top
FD2  1.27,76.2 0 bottom
FD3  20.32,1.27 0 top
FD4  20.32,1.27 0 bottom
FRAME1  -10.16,-25.4 0 top  (outside the outline)
H1  2.54,2.54 0 top
H2  22.86,2.54 0 top
H3  2.54,73.66 0 top
H4  22.86,73.66 0 top
IC1  10.16,19.05 180 top
IC3  10.16,11.43 180 top
J1  17.78,33.02 90 top
J2  1.27,6.35 90 top
J3  24.13,6.35 90 top
J4  12.7,6.35 0 top
LOGO1  12.7,62.23 0 bottom
LOGO2  12.7,79.38 0 bottom
ON_BTN  5.08,40.01 90 top
ON_LED  13.34,22.86 180 bottom
PWR_LED  13.34,26.04 180 bottom
R1  7.62,36.2 180 top
R2  18.54,17.14 270 top
R3  7.62,24.77 0 top
R4  7.62,22.86 0 top
R5  19.05,2.54 90 top
R6  6.35,2.54 90 top
R7  3.81,36.2 0 top
RST_BTN  8.89,40.01 90 top
SHLD  15.11,1.27 180 bottom
TP1  11.43,44.45 180 bottom
TP2  13.97,44.45 180 bottom
TP3  13.97,46.99 180 bottom
TP4  11.43,46.99 180 bottom
TP5  5.08,62.23 180 bottom
TP6  2.54,62.23 180 bottom
TP7  5.08,59.69 180 bottom
TP8  2.54,59.69 180 bottom
TP9  5.08,64.77 180 bottom
TP10  2.54,64.77 180 bottom
TP11  3.81,46.99 0 bottom
TP12  6.35,44.45 0 bottom
TP13  3.81,44.45 0 bottom
TP14  6.35,46.99 0 bottom
TP15  3.81,41.91 0 bottom
TP16  6.35,41.91 0 bottom
TP17  11.43,41.91 0 bottom
U1  12.7,57.15 270 top
U2  21.21,17.14 90 top
U$1  [LTE_STICK0]  12.7,80.9 0 top
U$2  [SFE_LOGO_FLAME_.2]  12.7,74.93 0 top
U$3  [#_3V3#0]  1.52,19.05 0 top
U$4  [#_GND#0]  1.52,16.51 0 top
U$5  [#_GND#0]  23.88,6.35 0 bottom
U$6  [#SHLD#0]  14.22,1.27 0 bottom
U$7  [#GND_#0]  23.88,6.35 0 top
U$8  [#GND_#0]  1.52,16.51 0 bottom
U$9  [#3V3_#0]  1.52,19.05 0 bottom
U$10  [#DTR#0]  3.17,57.15 0 bottom
U$11  [#VIN_#0]  23.88,8.89 0 top
U$12  [#3V3_#0]  23.88,11.43 0 top
U$13  [#1V8_#0]  23.88,13.97 0 top
U$14  [#_1V8#0]  23.88,13.97 0 bottom
U$15  [#_3V3#0]  23.88,11.43 0 bottom
U$16  [#_VIN#0]  23.88,8.89 0 bottom
U$17  [#_CTS#0]  1.52,26.67 0 top
U$18  [#_RTS#0]  1.52,29.21 0 top
U$19  [#RXD_#0]  1.52,21.59 0 bottom
U$20  [#TXD_#0]  1.52,24.13 0 bottom
U$21  [#_CLK#0]  1.52,11.43 0 top
U$22  [#_WA#0]  1.52,6.35 0 top
U$23  [#RXA_#0]  1.52,13.97 0 bottom
U$24  [#TXA_#0]  1.52,8.89 0 bottom
U$25  [LTE_STICK0]  12.7,59.69 0 bottom
U$26  [SIM_CARD0]  19.05,32.38 0 bottom
U$27  [VOLTAGE_LEVEL0]  12.7,54.61 0 bottom
U$28  [PWR0]  12.45,24.77 0 top
U$29  [ANT10]  20.57,76.83 0 top
U$30  [TEST_POINTS0]  15.24,52.07 0 bottom
U$31  [LARA#R60]  12.7,79.38 0 top
U$32  [#_RXA#0]  1.52,13.97 0 top
U$33  [#_#RST##0]  1.52,31.75 0 top
U$34  [PTH_PADS0]  15.24,49.53 0 bottom
U$35  [LARA#R60]  12.7,57.78 0 bottom
U$36  [ANT10]  21.08,76.83 0 bottom
U$37  [ON0]  3.3,43.18 0 top
U$38  [##PWR_ON#_#0]  1.52,34.29 0 bottom
U$39  [ON0]  12.45,22.86 0 top
U$40  [#_TXA#0]  1.52,8.89 0 top
U$41  [#_TXD#0]  1.52,24.13 0 top
U$42  [#_RXD#0]  1.52,21.59 0 top
U$43  [#CLK_#0]  1.52,11.43 0 bottom
U$44  [#WA_#0]  1.52,6.35 0 bottom
U$45  [#RTS_#0]  1.52,29.21 0 bottom
U$46  [#CTS_#0]  1.52,26.67 0 bottom
U$47  [##RESET#_#0]  1.52,31.75 0 bottom
U$48  [UART0]  7.75,25.53 90 bottom
U$49  [I2S0]  7.75,10.29 90 bottom
U$50  [1#8V0]  7.62,52.07 0 bottom
U$51  [ORIENTATION0]  19.05,31.11 0 bottom
U$52  [RST0]  9.02,43.18 0 top
U$53  [#ON_LED#0]  14.22,22.86 0 bottom
U$54  [3#3V0]  7.62,49.53 0 bottom
U$55  [ORDERING_INSTRUCTIONS]  40.64,50.8 0 top  (outside the outline)
U$56  [UART20]  3.81,66.67 0 bottom
U$57  [GPIO0]  5.08,40.01 0 bottom
U$58  [I2C0]  12.7,40.01 0 bottom
U$59  [#_#ON##0]  1.52,34.29 0 top
U$60  [#PWR_LED#0]  14.22,26.04 0 bottom
U$61  [ANT20]  4.7,76.83 0 bottom
U$62  [ANT20]  4.45,76.83 0 top

### Tracks (layer width: path | path; a pad name or v marks a point on that pad's centre or on a via)
1.8V  (via drill 0.3)
  Top 0.254: U1.4 5.67,64.77 v3.81,64.77 | v6.35,15.24 C7.1 8.04,16.51 7.78,16.77 IC1.16 | v6.35,7.62 C6.1 8.04,8.89 7.78,9.15 IC3.16 | IC3.7 11.71,13.05 v11.68,13.08 | IC1.7 12.09,20.68 11.43,21.34 v11.43,21.59 | IC3.1 11.7,9.15 | 11.7,9.15 v11.43,8.89 | IC1.1 13.57,16.77 13.97,16.37 v13.97,15.24 | v6.99,37.34 6.99,36.41 R1.2 | IC3.2 11.84,9.8 11.7,9.66 11.7,9.15
  Route15 0.254: v6.35,7.62 7.62,8.89
  Route15 0.508: J3.4 12.7,13.97
  Bottom 0.254: TP9.1 v3.81,64.77 | v3.17,43.18 3.17,42.55 TP15.1 | TP3.1 13.46,46.99 v12.7,47.75 | ON_LED.2 13.86,24.02 v13.97,24.13
  pour Route15 (isolate 0.178): 5.08,64.77 2.54,64.77 1.27,63.5 1.27,40.64 6.35,35.56 6.35,8.89 7.62,7.62 10.16,7.62 13.97,11.43 13.97,46.86 6.35,54.48 6.35,63.5
3.3V  (via drill 0.3)
  Top 0.254: IC1.15 6,17.43 v5.97,17.4 | IC3.15 6,9.8 v5.97,9.78
  Top 0.508: v22.86,20.95 v22.86,21.59 22.86,22.72 C9.+ 22.86,23 v22.86,24.13 v22.86,24.77 | J3.3 22.23,13.34 22.23,14.61 v23.5,15.88
  Bottom 0.254: v14.61,27.3 14.61,27.18 13.86,26.43 PWR_LED.2
  other vias: 21.59,66.04 21.59,67.31 21.59,68.58 20.32,69.85 24.13,16.51 24.77,15.88
  pour Route15 (isolate 0.178, rank 2): 25.4,0 0,0 0,82.55 25.4,82.55
  pour Top (isolate 0.178): 22.35,14.73 22.35,17.65 25.02,17.65 25.02,15.75 24,14.73
  pour Top (isolate 0.178): 19.05,65.66 21.59,65.66 21.84,65.91 21.84,69.85 19.56,72.14 19.56,75.06 18.67,75.06 18.67,71.12 19.05,70.74
5V
  Top 0.508: D7.A 17.14,10.9 17.65,10.39 F1.2
!PWR_ON!  (via drill 0.3)
  Top 0.254: U1.15 4.4,52.75 v3.81,53.34 | D9.A v1.27,41.27 2.05,42.05 ON_BTN.3 ON_BTN.4
  Bottom 0.254: v3.81,53.34 1.91,51.44 1.91,41.91 v1.27,41.27
!RESET!  (via drill 0.3)
  Top 0.254: U1.18 2.62,49.45 v2.54,49.53 | D10.A v2.54,41.15 | RST_BTN.4 8.09,40.01 | 8.09,40.01 RST_BTN.3 | v6.35,40.01 8.09,40.01
  Bottom 0.254: v2.54,49.53 v2.54,41.15 3.68,40.01 v6.35,40.01
ANT1
  Top 0.312: U1.56 16,70.61 15.49,71.12 15.49,76.51 D2.1 20.12,76.89 20.95,77.72 E2.SIG
ANT2
  Top 0.312: U1.62 9.4,70.62 9.91,71.13 9.91,76.51 D3.1 5.28,76.89 4.45,77.72 E1.SIG
CTS_18  (via drill 0.3)
  Top 0.254: U1.11 v3.81,57.15 | IC1.5 11.11,19.38 v10.79,19.68
  Bottom 0.254: v3.81,57.15 9.53,51.44 9.53,20.95 v10.79,19.68
CTS_33
  Top 0.254: IC1.12 4.75,19.38 3.81,20.32 3.81,24.13 J2.9
DCD/RXD2_18  (via drill 0.3)
  Top 0.254: v3.81,60.96 4.32,60.45 U1.8
  Bottom 0.254: TP7.1 v3.81,60.96
DSR/RTS2_18  (via drill 0.3)
  Top 0.254: v3.81,63.5 4.66,62.65 U1.6
  Bottom 0.254: TP5.1 v3.81,63.5
DTR/TXD2_18  (via drill 0.3)
  Top 0.254: v3.81,59.69 4.15,59.35 U1.9
  Bottom 0.254: v3.81,59.69 TP8.1 DTR.2
EN
  Top 0.254: R2.1 18.67,18.12 U2.5
GND  (via drill 0.3)
  Top 0.239: D1.2 v15.24,9.53
  Top 0.254: 9.49,6.86 8.76,6.86 | U1.14 7.2,53.85 U1.81 | U1.71 7.1,65.95 U1.3 | U1.65 7.2,67.65 U1.64 | U1.70 18.2,67.65 U1.54 | U1.50 18.69,64.85 18.54,64.71 18.03,64.71 | U1.22 7.2,46.65 U1.91 7.1,47.25 U1.20 | U1.32 18.2,46.65 U1.96
  Top 0.508: J4.GND2 15.93,6.96 v15.85,7.04 | J4.GND 9.47,7.36 C6.2
  other vias: 6.35,0.64 19.05,0.64 11.43,34.29 13.34,43.18 15.24,43.81 17.78,30.61 14.73,71.75 14.73,73.03 14.73,74.3 14.73,75.56 16.89,77.6 18.16,77.6 19.43,77.6 16.26,71.37 16.26,72.64 16.26,73.91 16.26,75.18 17.02,76.2 18.29,76.2 19.56,76.2 17.14,70.48 18.41,70.48 14.73,70.48 13.34,70.48 12.06,70.48 10.67,70.48 10.67,71.75 10.67,73.03 10.67,74.3 10.67,75.56 10.67,76.83 8.51,77.6 7.24,77.6 5.97,77.6 9.14,71.37 9.14,72.64 9.14,73.91 9.14,75.18 8.38,76.2 7.11,76.2 5.84,76.2 3.68,77.47 8.26,70.48 6.99,70.48 21.72,77.47 20.83,76.58 14.73,76.83 4.57,76.58 3.81,67.31 3.81,66.04 3.81,68.58 5.08,69.85 21.59,57.78 21.59,64.77 12.7,49.53 3.81,45.72 21.59,45.09 8.89,81.92 16.51,81.92 11.43,81.92 13.97,81.92 24.13,77.47 24.13,71.12 1.27,71.12 1.27,77.47 1.27,64.77 24.13,64.77 0.64,80.26 24.77,80.26 0.64,4.45 24.77,4.45 16.51,8.89 10.16,8.89 8.89,17.78 8.89,10.79 5.71,20.7 5.71,13.08 5.08,27.94 5.08,33.02 1.27,43.18 12.06,40.64 11.43,36.83 24.13,21.59 17.78,19.05 16.51,24.13 17.53,25.15 24.13,24.13 24.13,27.94 24.13,36.83 24.13,43.18 14.61,37.47 11.43,31.75 22.86,49.53 22.86,54.61 22.86,52.07 22.86,46.99 2.54,54.61 2.54,60.96 7.11,62.23 18.29,62.23 17.78,58.42 7.62,58.42 9.53,53.85 15.88,53.85 12.7,66.55 8.51,66.55 16.89,66.55 10.54,66.55 14.86,66.55 15.88,64.14 9.53,64.14 8.89,60.33 16.51,60.33 7.62,56.52 17.78,56.52 22.86,10.16 16.51,35.56 21.59,30.61 21.59,33.15 3.17,33.02 6.99,38.73 20.7,19.05 21.72,19.05 21.72,15.24 20.7,15.24 19.05,20.32 20.32,21.59 15.88,27.3 12.06,28.57 12.06,29.84
  pour Top (isolate 0.178, rank 2): 0,0 25.4,0 25.4,82.55 0,82.55
  pour Route2 (isolate 0.178, rank 2): 0,0 25.4,0 25.4,82.55 0,82.55
  pour Bottom (isolate 0.178): 25.4,0 0,0 0,82.55 25.4,82.55
I2S_CLK_18  (via drill 0.3)
  Top 0.254: U1.36 21.04,49.45 v21.59,48.9 | IC3.5 10.1,11.76 v9.78,11.43
  Bottom 0.254: v21.59,48.9 19.68,46.99 19.68,24.77 9.78,14.86 v9.78,11.43
I2S_CLK_33
  Top 0.254: J2.3 2.54,11.43 2.87,11.76 IC3.12
I2S_RXA_18  (via drill 0.3)
  Top 0.254: U1.37 21.2,50.55 v21.59,50.16 | IC3.6 9.48,12.4 v9.14,12.06
  Bottom 0.254: v21.59,50.16 19.05,47.62 19.05,25.4 9.14,15.49 v9.14,12.06
I2S_RXA_33
  Top 0.254: IC3.11 2.83,12.4 J2.4
I2S_TXA_18  (via drill 0.3)
  Top 0.254: U1.35 20.86,48.35 v21.59,47.62 | IC3.4 10.72,11.11 v10.41,10.79
  Bottom 0.254: v21.59,47.62 20.32,46.35 20.32,24.13 10.41,14.22 v10.41,10.79
I2S_TXA_33
  Top 0.254: IC3.13 3.48,11.11 J2.2
I2S_WA_18  (via drill 0.3)
  Top 0.254: U1.34 20.7,47.25 v21.59,46.35 | IC3.3 11.34,10.46 v11.05,10.16
  Bottom 0.254: v21.59,46.35 20.95,45.72 20.95,23.5 11.05,13.59 v11.05,10.16
I2S_WA_33
  Top 0.254: IC3.14 5.38,10.46 J2.1
IO1_18  (via drill 0.3)
  Top 0.254: U1.16 4.23,51.65 v3.81,52.07
  Bottom 0.254: v3.81,52.07 3.17,51.44 3.17,47.62 TP11.1
IO2_18  (via drill 0.3)
  Top 0.254: U1.23 8.3,44.7 7.41,43.81 5.71,43.81 v5.08,44.45
  Bottom 0.254: TP12.1 v5.08,44.45
IO3_18  (via drill 0.3)
  Top 0.254: U1.24 9.4,44.71 7.87,43.18 v5.08,43.18
  Bottom 0.254: TP13.1 v5.08,43.18
IO4_18  (via drill 0.3)
  Top 0.254: U1.25 10.5,43.6 v10.92,43.18
  Bottom 0.254: TP17.1 10.92,42.42 v10.92,43.18
IO6_18  (via drill 0.3)
  Top 0.254: U1.19 3.9,48.35 v3.81,48.26
  Bottom 0.254: TP14.1 5.08,48.26 v3.81,48.26
N$1
  Top 0.254: R3.2 D5.C
N$2  (via drill 0.3)
  Top 0.254: D5.A v11.43,25.64 v11.43,25.65
  Bottom 0.254: PWR_LED.1 11.81,26.04 v11.43,25.65
N$3  (via drill 0.3)
  Top 0.254: D6.A 11.43,23.74 v11.43,23.75
  Bottom 0.254: v11.43,23.75 11.43,23.11 11.68,22.86 ON_LED.1
N$4
  Top 0.254: R4.2 D6.C
N$5  (via drill 0.3)
  Top 0.254: v2.54,37.47 D10.C
  Bottom 0.254: J2.11 2.54,33.02 v2.54,37.47
N$6
  Top 0.254: J2.12 D9.C
N$7
  Top 0.305: U2.8 18.67,16.17 R2.2
  pour Top (isolate 0.178): 16.76,14.35 18.8,14.35 19.94,15.49 19.94,16.51 16.76,16.51
N$8  (via drill 0.3)
  Top 0.254: J4.B5 14.45,5.43 v13.97,4.95 | R5.2 18,3.39 v17.78,3.17
  Bottom 0.254: v17.78,3.17 15.75,3.17 v13.97,4.95
N$9  (via drill 0.3)
  Top 0.254: J4.A5 11.45,4.97 v11.43,4.95 | R6.2 7.41,3.39 v7.62,3.17
  Bottom 0.254: v7.62,3.17 9.65,3.17 v11.43,4.95
N$10
  Top 0.239: J4.A6 12.45,6.56 12.7,6.81 13.45,6.81 | 13.45,6.81 J4.B6 | D1.3 15.74,9.91 15.89,9.76 15.89,9.29 13.45,6.85 13.45,6.81
N$11
  Top 0.239: J4.A7 12.95,5.46 12.7,5.21 12.19,5.21 11.95,5.45 J4.B7 11.95,6.67 12.52,7.24 13.23,7.24 14.59,8.59 14.59,9.76 14.74,9.91 D1.1
RI/CTS2_18  (via drill 0.3)
  Top 0.254: U1.7 4.49,61.55 v3.81,62.23
  Bottom 0.254: TP6.1 v3.81,62.23
RTS_18  (via drill 0.3)
  Top 0.254: U1.10 3.98,58.25 v3.81,58.42 | IC1.6 11.72,20.02 v11.43,20.32
  Bottom 0.254: v3.81,58.42 10.16,52.07 10.16,21.59 v11.43,20.32
RTS_33
  Top 0.254: IC1.11 5.38,20.02 4.45,20.95 4.45,26.04 J2.10 3.81,31.75 3.81,35.34 R7.2
RXD_18  (via drill 0.3)
  Top 0.254: U1.13 4.15,54.95 v3.81,54.61 | IC1.3 9.87,18.07 v9.53,18.41
  Bottom 0.254: v3.81,54.61 8.26,50.16 8.26,19.68 v9.53,18.41
RXD_33
  Top 0.254: IC1.14 3.52,18.07 2.54,19.05 2.54,20.32 J2.7
SCL_18  (via drill 0.3)
  Top 0.254: U1.27 v12.7,43.81
  Bottom 0.254: TP2.1 13.34,43.81 v12.7,43.81
SDA_18  (via drill 0.3)
  Top 0.254: U1.26 11.6,43.65 v12.06,43.18
  Bottom 0.254: TP1.1 12.06,43.81 v12.06,43.18
SHLD
  Bottom 0.254: SHLD.2 17,1.27 J4.SHLD4
  pour Route2 (isolate 0.178): 8.38,1.14 17.02,1.14 17.02,5.59 8.38,5.59
SIM_CLK  (via drill 0.3)
  Top 0.254: U1.38 21.38,51.65 v21.59,51.44 | C2.1 8.6,26.67 10.12,28.2 J1.C3 11.18,28.2 v11.43,27.94 | D4.4 18.3,39.49 v18.41,39.37
  Bottom 0.254: v11.43,27.94 12.7,27.94 18.41,33.66 v18.41,39.37 18.41,48.26 v21.59,51.44
SIM_DET  (via drill 0.3)
  Top 0.254: v11.43,35.56 11.37,35.49 J1.CD 9.17,35.49 R1.1 | U1.42 21.12,56.05 v21.59,56.52
  Bottom 0.254: v11.43,35.56 13.97,35.56 15.88,37.47 15.88,50.8 v21.59,56.52
SIM_IO  (via drill 0.3)
  Top 0.254: U1.39 21.55,52.75 v21.59,52.7 | C3.1 8.62,28.57 9.51,29.46 J1.C7 11.18,29.46 v11.43,29.21 | D4.6 18.3,42.66 v17.78,43.18
  Bottom 0.254: v11.43,29.21 12.7,29.21 17.78,34.29 v17.78,43.18 17.78,48.9 v21.59,52.7
SIM_RST  (via drill 0.3)
  Top 0.254: C1.1 8.72,30.73 J1.C2 11.18,30.73 v11.43,30.48 | U1.40 21.46,53.85 v21.59,53.98 | D4.3 16.19,40.33 v17.14,39.37
  Bottom 0.254: v11.43,30.48 12.7,30.48 17.14,34.92 v17.14,39.37 17.14,49.53 v21.59,53.98
TXD_18  (via drill 0.3)
  Top 0.254: U1.12 3.98,56.05 v3.81,55.88 | IC1.4 10.48,18.73 v10.16,19.05
  Bottom 0.254: v3.81,55.88 8.89,50.8 8.89,20.32 v10.16,19.05
TXD_33
  Top 0.254: IC1.13 4.13,18.73 3.17,19.68 3.17,22.23 J2.8
USB_N
  Top 0.239: D1.6 14.74,11.61 14.59,11.76 14.59,12.34 15.03,12.78 15.03,25.02 18.41,28.4 18.41,35.31 14.09,39.63 14.09,44.91 U1.28
USB_P
  Top 0.239: D1.4 15.74,11.61 15.89,11.76 15.89,12.34 15.45,12.78 15.45,24.85 18.83,28.23 18.83,35.48 14.52,39.8 14.52,44.46 14.62,44.56 14.62,44.92 U1.29
V_USB  (via drill 0.3)
  Top 0.239: D1.5 v15.24,12.06
  Top 0.254: U1.17 4.06,50.55 v3.81,50.8
  Top 0.508: J4.VBUS2 15.15,6.52 14.99,6.68 v14.99,7.26 14.99,7.39 15.47,7.87 16.38,7.87 16.87,7.39 F1.1
  Bottom 0.254: v3.81,50.8 6.35,50.8 7.62,49.53 7.62,10.16 10.16,7.62 14.61,7.62 | 14.61,7.62 14.61,11.43 v15.24,12.06 | v14.99,7.26 14.96,7.26 14.61,7.62
  pour Top (isolate 0.178, no thermals): 10.03,6.35 10.03,4.95 11.05,3.94 14.35,3.94 15.37,4.95 15.37,6.35
VIN
  Top 0.508: D8.A 19.43,12.19 22.73,8.89 J3.2
VSIM  (via drill 0.3)
  Top 0.254: U1.41 21.3,54.95 v21.59,55.24 | v11.43,33.02 11.18,33.27 J1.C1 9.36,33.27 C4.1 C5.1 | D4.1 15.99,42.66 v16.51,43.18
  Bottom 0.254: v11.43,33.02 12.7,33.02 16.51,36.83 v16.51,43.18 16.51,50.16 v21.59,55.24

### Text on the board
Top: 1
Route2: 2
Route15: 3
Bottom: 4 | v11
Measures: Units: inches
tDocu: 4-layer / JLC7628 Stackup / Material: TG155 / 1oz outer layers / 0.5oz inner layers / Board thickness: 1.6mm / Soldermask: Red / Silkscreen: White / Surface Finish: Lead-Free HASL | Dryw Wade